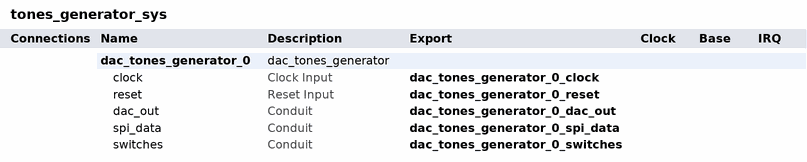
[diagram p0: system contents]
# Platform Designer (Qsys) system tones_generator_sys, MAX 10 10M50DAF484C6GES
# Parameters at their usual value, and those the tool derives, are not listed.
package require qsys
create_system tones_generator_sys
set_project_property DEVICE_FAMILY {MAX 10}
set_project_property DEVICE 10M50DAF484C6GES

add_instance dac_tones_generator_0 dac_tones_generator 1.0

# exported interfaces
add_interface dac_tones_generator_0_clock clock sink
set_interface_property dac_tones_generator_0_clock EXPORT_OF dac_tones_generator_0.clock
add_interface dac_tones_generator_0_dac_out conduit end
set_interface_property dac_tones_generator_0_dac_out EXPORT_OF dac_tones_generator_0.dac_out
add_interface dac_tones_generator_0_reset reset sink
set_interface_property dac_tones_generator_0_reset EXPORT_OF dac_tones_generator_0.reset
add_interface dac_tones_generator_0_spi_data conduit end
set_interface_property dac_tones_generator_0_spi_data EXPORT_OF dac_tones_generator_0.spi_data
add_interface dac_tones_generator_0_switches conduit end
set_interface_property dac_tones_generator_0_switches EXPORT_OF dac_tones_generator_0.switches

set_interconnect_requirement {$system} qsys_mm.clockCrossingAdapter HANDSHAKE
set_interconnect_requirement {$system} qsys_mm.enableEccProtection FALSE
set_interconnect_requirement {$system} qsys_mm.insertDefaultSlave FALSE
set_interconnect_requirement {$system} qsys_mm.maxAdditionalLatency 1

save_system tones_generator_sys.qsys
